# EAGLE design gameboypocket (EAGLE 6.5.0)
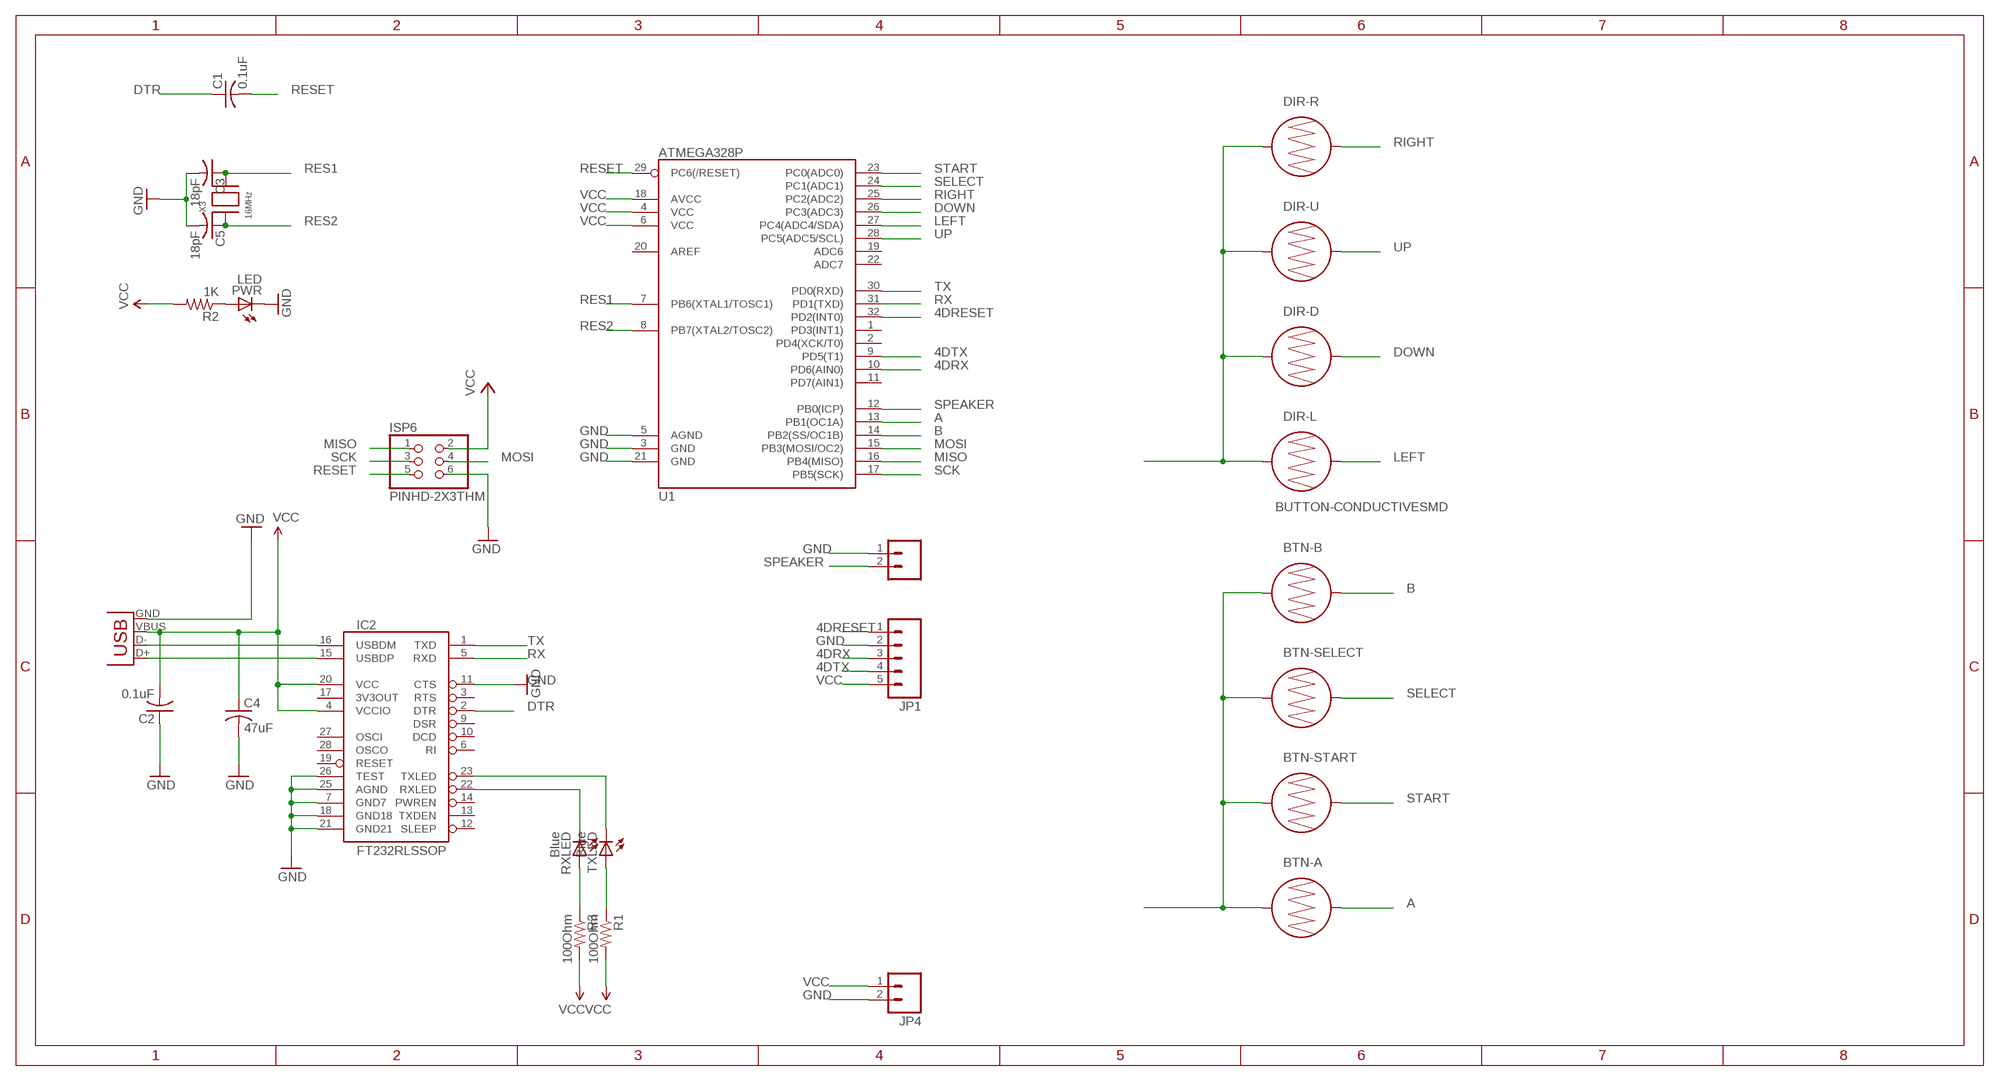
[diagram p0: schematic, sheet 1]

## Parts
BTN-A  BUTTON-CONDUCTIVESMD  [BUTTON-CONDUCTIVE]
BTN-B  BUTTON-CONDUCTIVESMD  [BUTTON-CONDUCTIVE]
BTN-SELECT  BUTTON-CONDUCTIVESMD  [BUTTON-CONDUCTIVE]
BTN-START  BUTTON-CONDUCTIVESMD  [BUTTON-CONDUCTIVE]
C1  0.1uF  C-USC0805K  [C0805K]
C2  0.1uF  C-USC0805K  [C0805K]
C3  18pF  C-USC0805K  [C0805K]
C4  47uF  C-USC1206  [C1206]
C5  18pF  C-USC0805K  [C0805K]
DIR-D  BUTTON-CONDUCTIVESMD  [BUTTON-CONDUCTIVE]
DIR-L  BUTTON-CONDUCTIVESMD  [BUTTON-CONDUCTIVE]
DIR-R  BUTTON-CONDUCTIVESMD  [BUTTON-CONDUCTIVE]
DIR-U  BUTTON-CONDUCTIVESMD  [BUTTON-CONDUCTIVE]
IC2  FT232RLSSOP  [SSOP28DB]
ISP6  PINHD-2X3THM  [ISP6]
JP1  M05PTH  [1X05]
JP2  M02PTH  [1X02]
JP4  M02JST-PTH-2  [JST-2-PTH]
PWR  LED  LEDCHIPLED_0805  [CHIPLED_0805]
R1  100Ohm  R-US_R0805  [R0805]
R2  1K  R-US_R0805  [R0805]
R3  100Ohm  R-US_R0805  [R0805]
RXLED  Blue  LEDCHIPLED_0805  [CHIPLED_0805]
TXLED  Blue  LEDCHIPLED_0805  [CHIPLED_0805]
U1  ATMEGA328P  ATMEGA168  [TQFP32-08]
X1  USBSMD  [USB-MINIB]
X3  16MHz  XTALNX5032  [NX5032]

## Nets
4DRESET: JP1.1 U1.32(PD2(INT0))
4DRX: JP1.3 U1.10(PD6(AIN0))
4DTX: JP1.4 U1.9(PD5(T1))
A: BTN-A.2 U1.13(PB1(OC1A))
B: BTN-B.2 U1.14(PB2(SS/OC1B))
D+: IC2.15(USBDP) X1.D+
D-: IC2.16(USBDM) X1.D-
DOWN: DIR-D.2 U1.26(PC3(ADC3))
DTR: C1.1 IC2.2(DTR)
GND: BTN-A.1 BTN-B.1 BTN-SELECT.1 BTN-START.1 C2.1 C3.2 C4.2 C5.2 DIR-D.1 DIR-L.1 DIR-R.1 DIR-U.1 IC2.7(GND7) IC2.11(CTS) IC2.18(GND18) IC2.21(GND21) IC2.25(AGND) IC2.26(TEST) ISP6.6 JP1.2 JP2.1 JP4.2 PWR.C U1.3(GND) U1.5(AGND) U1.21(GND) X1.GND
LEFT: DIR-L.2 U1.27(PC4(ADC4/SDA))
MISO: ISP6.1 U1.16(PB4(MISO))
MOSI: ISP6.4 U1.15(PB3(MOSI/OC2))
N$1: PWR.A R2.1
N$10: R3.1 RXLED.A
N$11: R1.1 TXLED.A
RES1: C3.1 U1.7(PB6(XTAL1/TOSC1)) X3.P$2
RES2: C5.1 U1.8(PB7(XTAL2/TOSC2)) X3.P$1
RESET: C1.2 ISP6.5 U1.29(PC6(/RESET))
RIGHT: DIR-R.2 U1.25(PC2(ADC2))
RX: IC2.5(RXD) U1.31(PD1(TXD))
RXLED: IC2.22(RXLED) RXLED.C
SCK: ISP6.3 U1.17(PB5(SCK))
SELECT: BTN-SELECT.2 U1.24(PC1(ADC1))
SPEAKER: JP2.2 U1.12(PB0(ICP))
START: BTN-START.2 U1.23(PC0(ADC0))
TX: IC2.1(TXD) U1.30(PD0(RXD))
TXLED: IC2.23(TXLED) TXLED.C
UP: DIR-U.2 U1.28(PC5(ADC5/SCL))
VCC: C2.2 C4.1 IC2.4(VCCIO) IC2.20(VCC) ISP6.2 JP1.5 JP4.1 R1.2 R2.2 R3.2 U1.4(VCC) U1.6(VCC) U1.18(AVCC) X1.VBUS
Unconnected: IC2.3(RTS) IC2.6(RI) IC2.9(DSR) IC2.10(DCD) IC2.12(SLEEP) IC2.13(TXDEN) IC2.14(PWREN) IC2.17(3V3OUT) IC2.19(RESET) IC2.27(OSCI) IC2.28(OSCO) U1.1(PD3(INT1)) U1.2(PD4(XCK/T0)) U1.11(PD7(AIN1)) U1.19(ADC6) U1.20(AREF) U1.22(ADC7)

## Library data of the parts
BTN-A BTN-B BTN-SELECT BTN-START DIR-D DIR-L DIR-R DIR-U = SparkFun-Electromechanical:BUTTON-CONDUCTIVE: Used with rubber key pads. This one was designed and proven to work with the PolyCase Key FOB enclosures.
C1 C2 C4 = rcl:C-US: CAPACITOR, American symbol
C3 C5 = adafruit:C-US: CAPACITOR, American symbol
IC2 = SparkFun:FT232RL: USB UART FT232RL 4th Generation USB UART (USB <-> Serial) Controller. Spark Fun Electronics SKU : COM-00650
ISP6 = adaprog:PINHD-2X3
JP1 = SparkFun-Connectors:M05: Header 5 Standard 5-pin 0.1" header. Use with straight break away headers (SKU : PRT-00116), right angle break away headers (PRT-00553), swiss pins (PRT-00743), machine pins (PRT-00117), and female headers (PRT-00115). Molex polarized connector foot print use with SKU : PRT-08230 with associated crimp pins and housings.
JP2 JP4 = SparkFun-Connectors:M02: Header 2 Standard 2-pin 0.1" header. Use with straight break away headers (SKU : PRT-00116), right angle break away headers (PRT-00553), swiss pins (PRT-00743), machine pins (PRT-00117), and female headers (PRT-00115). Molex polarized connector foot print use with SKU : PRT-08233 with associated crimp pins and housings.
PWR = adafruit:LED: LED
R1-R3 = adafruit:R-US_: RESISTOR, American symbol
RXLED TXLED = led:LED: LED
U1 = SparkFun:ATMEGA168
X1 = SparkFun:USB: USB Connectors USB-B-PTH is fully proven SKU : PRT-00139 USB-miniB is fully proven SKU : PRT-00587 USB-A-PCB is untested. USB-A-H is throughly reviewed, but untested. Spark Fun Electronics SKU : PRT-00437 USB-B-SMT is throughly reviewed, but untested. Needs silkscreen touching up. USB-A-S has not been used/tested USB-MB-H has not been used/tested
X3 = adaprog:XTAL

## Board
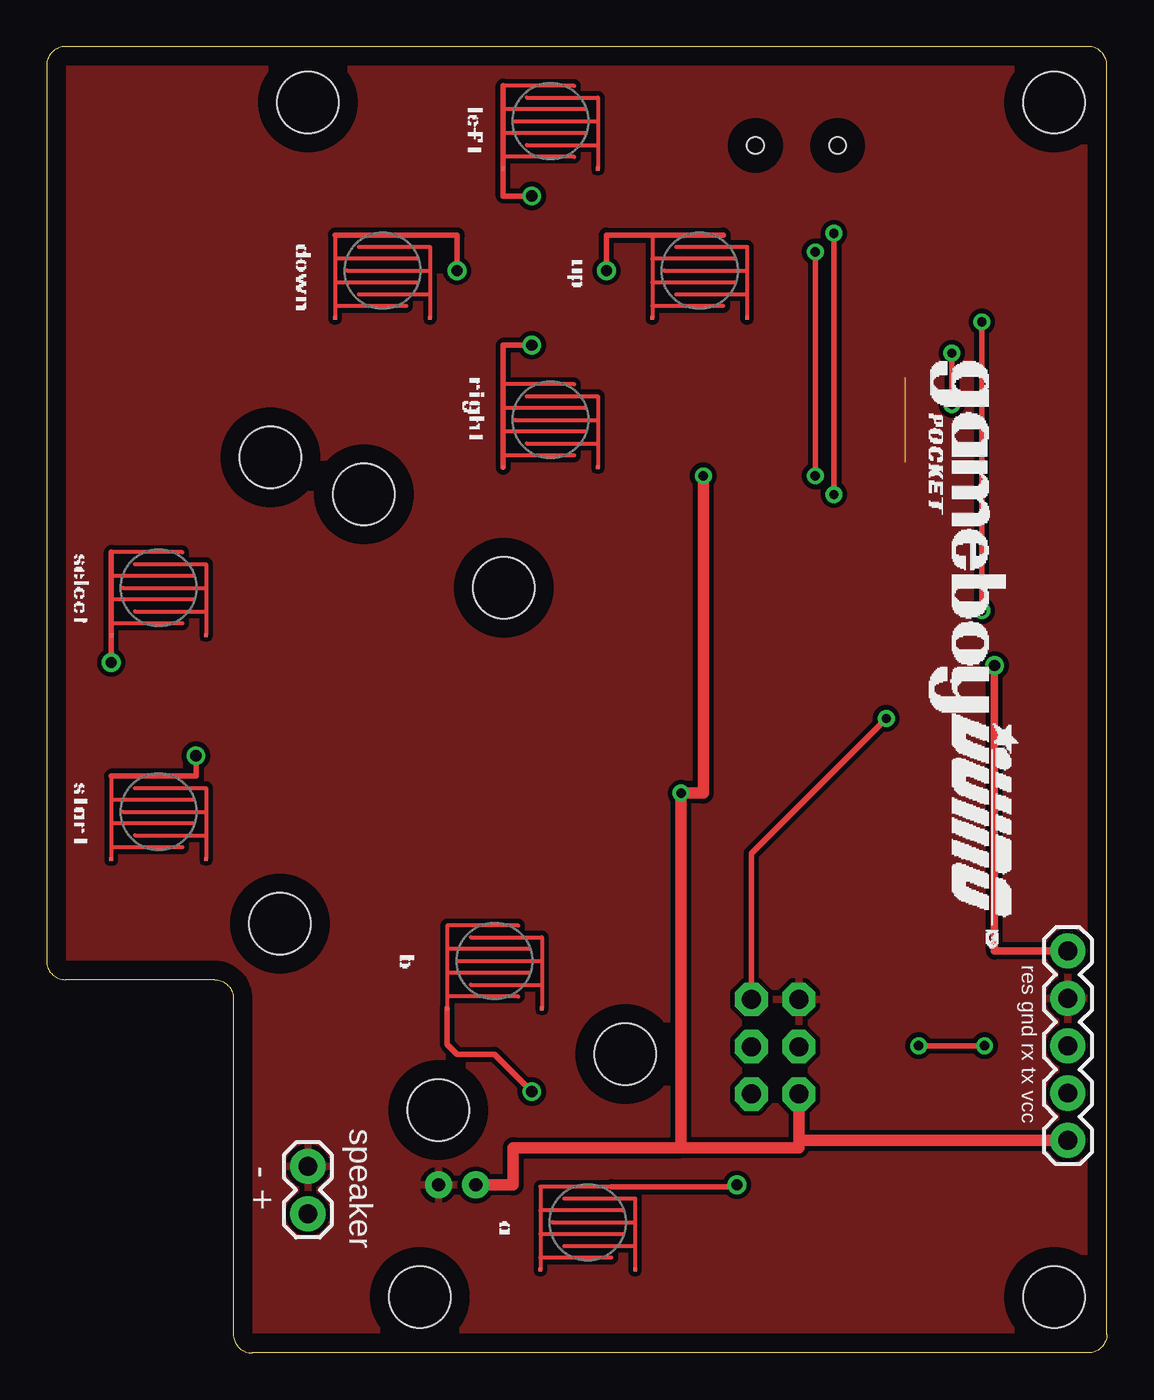
[diagram p1: board, top side]
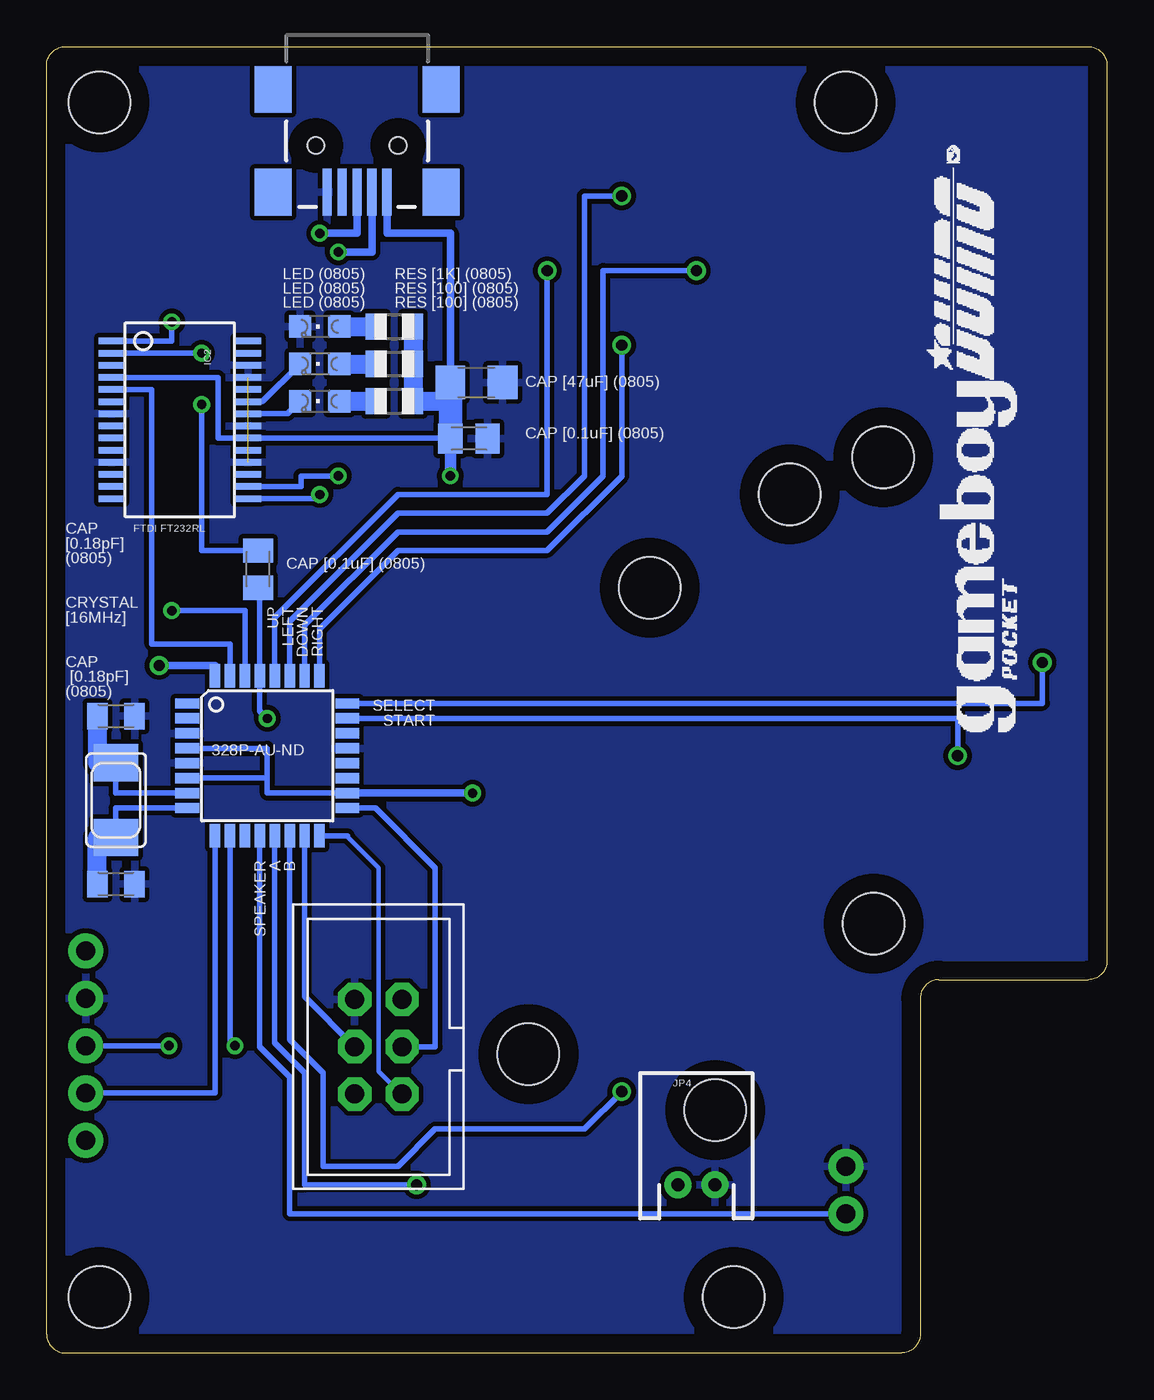
[diagram p2: board, bottom side, seen from below]

Size 56.83 x 70 mm. Coordinates in mm from the lower left corner, seen from the top.
Outline: 10,19 10,1 arc90 11,0 55.83,0 arc90 56.83,1 56.83,69 arc90 55.83,70 1,70 arc90 0,69 0,21 arc90 1,20 9,20 arc-90 10,19
Copper layers (1*16): Top 0.035mm / dielectric 1.5mm / Bottom 0.035mm
Design rules "default *": minimum track width 10mil, minimum drill 20mil, track to track 10mil, track to pad 10mil, pad to pad 10mil, via to via 10mil, smd to smd 10mil, copper to edge 40mil, drill to drill 20mil, minimum pad ring 10mil, minimum via ring 8mil, stop-mask expansion 4mil, vias tented up to drill 20mil, thermal gap 10mil

### Footprints (pad centres in the part's own frame; a part is rotated, then mirrored left to right if it is on the bottom)
BUTTON-CONDUCTIVE = smd 0.203 x 0.203: 1 2.54,2.54; 2 2.54,-2.54
C0805K = smd 1.3 x 1.6: 1 -1,0; 2 1,0
C0805K' = smd 1.1 x 1.4: 1 -1,0; 2 1,0
C1206 = smd 1.6 x 1.8: 1 -1.4,0; 2 1.4,0
SSOP28DB = smd 0.348 x 1.397: 1 -4.225,-3.656; 2 -3.575,-3.656; 3 -2.925,-3.656; 4 -2.275,-3.656; 5 -1.625,-3.656; 6 -0.975,-3.656; 7 -0.325,-3.656; 8 0.325,-3.656; 9 0.975,-3.656; 10 1.625,-3.656; 11 2.275,-3.656; 12 2.925,-3.656; 13 3.575,-3.656; 14 4.225,-3.656; 15 4.225,3.656; 16 3.575,3.656; 17 2.925,3.656; 18 2.275,3.656; 19 1.625,3.656; 20 0.975,3.656; 21 0.325,3.656; 22 -0.325,3.656; 23 -0.975,3.656; 24 -1.625,3.656; 25 -2.275,3.656; 26 -2.925,3.656; 27 -3.575,3.656; 28 -4.225,3.656
ISP6 = drill 1.016 pad 1.778 octagon: 1 -2.54,-1.27; 2 -2.54,1.27; 3 0,-1.27; 4 0,1.27; 5 2.54,-1.27; 6 2.54,1.27
1X05 = drill 1.016 pad 1.88: 1 0,0; 2 2.54,0; 3 5.08,0; 4 7.62,0; 5 10.16,0
1X02 = drill 1.016 pad 1.88: 1 0,0; 2 2.54,0
JST-2-PTH = drill 0.7 pad 1.448: 1 -1,0; 2 1,0
CHIPLED_0805 = smd 1.2 x 1.2: A 0,-1.05; C 0,1.05
R0805 = smd 1.1 x 1.4: 1 -1,0; 2 1,0
TQFP32-08 = smd 1.27 x 0.559: 1 -4.293,2.8; 2 -4.293,2; 3 -4.293,1.2; 4 -4.293,0.4; 5 -4.293,-0.4; 6 -4.293,-1.2; 7 -4.293,-2; 8 -4.293,-2.8; 17 4.293,-2.8; 18 4.293,-2; 19 4.293,-1.2; 20 4.293,-0.4; 21 4.293,0.4; 22 4.293,1.2; 23 4.293,2; 24 4.293,2.8 | smd 0.559 x 1.27: 9 -2.8,-4.293; 10 -2,-4.293; 11 -1.2,-4.293; 12 -0.4,-4.293; 13 0.4,-4.293; 14 1.2,-4.293; 15 2,-4.293; 16 2.8,-4.293; 25 2.8,4.293; 26 2,4.293; 27 1.2,4.293; 28 0.4,4.293; 29 -0.4,4.293; 30 -1.2,4.293; 31 -2,4.293; 32 -2.8,4.293
STAND-OFF = hole 3.302: 0,0
USB-MINIB = smd 2.5 x 0.5: D+ 2.5,0; D- 2.5,0.8; GND 2.5,-1.6; ID 2.5,-0.8; VBUS 2.5,1.6 | smd 2.5 x 2: GND@1 -3,-4.5; GND@2 -3,4.5; GND@3 2.5,4.5; GND@4 2.5,-4.5 | hole 0.9: 0,2.2; 0,-2.2
NX5032 = smd 2 x 2.4: P$1 2,0; P$2 -2,0

### Placement (x,y rotation side)
BTN-A  29,7 270 top
BTN-B  24,21 270 top
BTN-SELECT  6,41 270 top
BTN-START  6,29 270 top
C1  45.5,42 270 bottom
C2  34.19,49 180 bottom
C3  18pF  [C0805K']  53.11,34.12 0 bottom
C4  33.79,52 0 bottom
C5  18pF  [C0805K']  53.11,25.12 0 bottom
DIR-D  18,58 270 top
DIR-L  27,66 270 top
DIR-R  27,50 270 top
DIR-U  35,58 270 top
IC2  49.69,50 270 bottom
ISP6  39.04,16.41 90 bottom
JP1  54.73,21.54 270 top
JP2  14,10 270 top
JP4  22,9 0 bottom
PWR  42.19,55 90 bottom
R1  38.19,53 0 bottom
R2  38.19,55 0 bottom
R3  38.19,51 0 bottom
RXLED  42.19,51 90 bottom
TXLED  42.19,53 90 bottom
U1  45,32 0 bottom
U$3  [STAND-OFF]  14,67 0 top
U$4  [STAND-OFF]  12.5,23 0 top
U$5  [STAND-OFF]  20,3 0 top
U$6  [STAND-OFF]  24.5,41 0 top
U$7  [STAND-OFF]  17,46 0 top
U$8  [STAND-OFF]  54,67 0 top
U$9  [STAND-OFF]  21,13 0 top
U$10  [STAND-OFF]  12,48 0 top
U$11  [STAND-OFF]  31,16 0 top
U$12  [STAND-OFF]  54,3 0 top
X1  40.19,64.7 270 bottom
X3  53.11,29.62 270 bottom

### Tracks (layer width: path | path; a pad name or v marks a point on that pad's centre or on a via)
4DRESET  (via drill 0.6)
  Top 0.406: JP1.1 50.8,21.54 v50.8,36.83
  Bottom 0.406: v50.8,36.83 47.8,36.83 U1.32
4DRX  (via drill 0.5)
  Top 0.305: v46.74,16.46 v50.27,16.46
  Bottom 0.305: v50.27,16.46 JP1.3 | U1.10 47,16.46 v46.74,16.46
4DTX
  Bottom 0.305: JP1.4 47.8,13.92 U1.9
A  (via drill 0.6)
  Top 0.305: 30.27,8.9 36.91,8.9 v37,9
  Bottom 0.305: U1.13 44.6,16.6 43,15 43,9 v37,9
B  (via drill 0.6)
  Top 0.305: BTN-B.2 21.46,16.54 22,16 24,16 v26,14
  Bottom 0.305: U1.14 43.8,16.8 42,15 42,10 38,10 36,12 28,12 v26,14
D+  (via drill 0.5)
  Top 0.305: v42.19,60 v42.19,46
  Bottom 0.305: v42.19,46 42.19,45.77 IC2.15
  Bottom 0.406: X1.D+ 40.19,60 v42.19,60
D-  (via drill 0.5)
  Top 0.305: v41.19,59 v41.19,47
  Bottom 0.305: v41.19,47 43.19,47 43.19,46.42 IC2.16
  Bottom 0.406: X1.D- 39.39,59 v41.19,59
DOWN  (via drill 0.6)
  Top 0.305: v22,58 22,59.91 15.46,59.91
  Bottom 0.305: U1.26 43,39 38,44 30,44 27,47 27,58 v22,58
DTR  (via drill 0.5)
  Top 0.305: v48.52,53.58 v48.52,50.82
  Bottom 0.305: IC2.2 v48.52,53.58 | v48.52,50.82 48.52,43 C1.1
GND  (2 unrouted)
  pour Top: 0,70 0,20 10,20 10,0 56.83,0 56.83,70
  pour Bottom: 0,70 56.83,70 56.83,0 10,0 10,20 0,20
LEFT  (via drill 0.6)
  Top 0.305: v26,62 24.46,62 24.46,67.91
  Bottom 0.305: U1.27 43.8,39.2 38,45 30,45 28,47 28,62 v26,62
MISO
  Bottom 0.254: 41,27.71 40.75,27.71 39.04,26 39.04,15.1 37.81,13.87 ISP6.1
  Bottom 0.305: 40.71,27.71 41,27.71 U1.16
MOSI
  Bottom 0.305: ISP6.4 43,19.1 U1.15
N$1
  Bottom 1.016: PWR.A R2.1
N$10
  Bottom 1.016: RXLED.A R3.1
N$11
  Bottom 1.016: TXLED.A R1.1
RES1
  Bottom 0.305: X3.P$2 53.11,30 U1.7
  Bottom 1.016: C3.1 54.11,31.62 X3.P$2
RES2
  Bottom 0.305: U1.8 53.11,29.2 X3.P$1
  Bottom 1.016: C5.1 54.11,27.62 X3.P$1
RESET  (via drill 0.5)
  Top 0.305: ISP6.5 37.77,26.77 v45,34
  Bottom 0.305: C1.2 45.4,41 U1.29 45.4,34.4 v45,34
RIGHT  (via drill 0.6)
  Top 0.305: v26,54 24.46,54 DIR-R.2
  Bottom 0.305: U1.25 42.2,38.8 38,43 30,43 26,47 v26,54
RX
  Bottom 0.305: U1.31 47,38 51.19,38 51.19,51.62 IC2.5
RXLED
  Bottom 0.305: IC2.22 43.91,50.33 RXLED.C
SCK
  Bottom 0.305: ISP6.3 36,16.41 36,26 39.2,29.2 U1.17
SELECT  (via drill 0.6)
  Top 0.305: v3.46,37 3.46,42.91
  Bottom 0.305: U1.24 3.46,34.8 v3.46,37
SPEAKER
  Bottom 0.305: JP2.2 43.8,7.46 43.8,14.8 45.4,16.4 U1.12
START  (via drill 0.6)
  Top 0.305: v8,32 8,30.91 3.46,30.91
  Bottom 0.305: U1.23 8,34 v8,32
TX  (via drill 0.5)
  Top 0.305: v50.12,39.77 v50.12,55.25
  Bottom 0.305: U1.30 46.2,39.77 v50.12,39.77 | v50.12,55.25 50.12,54.23 IC2.1
TXLED
  Bottom 0.305: IC2.23 45.27,50.98 TXLED.C
UP  (via drill 0.6)
  Top 0.305: v30,58 30,59.91 36.27,59.91
  Bottom 0.305: U1.28 44.6,39.4 38,46 30,46 v30,58
VCC  (via drill 0.5)
  Top 0.61: v35.19,47 35.19,30 v34,30 34,11 | ISP6.2 40.31,11.38 | 34,11 40.31,11 40.31,11.38 | 40.31,11.38 JP1.5 | 34,11 25,11 25,9 JP4.1
  Bottom 0.305: C2.2 35.22,49.02 IC2.20 47.63,49.02 47.63,52.27 IC2.4 | 45,30.8 45,30 U1.18 | 45,30.8 U1.6 | U1.4 45,32.4 45,30.8
  Bottom 0.406: X1.VBUS 38.59,60 35.19,60 C4.1 | U1.18 v34,30
  Bottom 0.61: v35.19,47 C2.2
  Bottom 1.016: R2.2 R1.2 R3.2 35.19,51
  Bottom 1.27: C2.2 35.19,51 C4.1

### Text on the board
tPlace: res gnd rx tx vcc | - + | speaker
bPlace: RES [1K] (0805) / RES [100] (0805) / RES [100] (0805) | LED (0805) / LED (0805) / LED (0805) | CAP [47uF] (0805) / / / CAP [0.1uF] (0805) | FTDI FT232RL | CAP [0.1uF] (0805) | UP / LEFT / DOWN / RIGHT | SELECT / START | CAP / [0.18pF] / (0805) / / / CRYSTAL / [16MHz] / / / CAP / [0.18pF] / (0805) | 328P-AU-ND | SPEAKER / A / B